# EAGLE board XMICRO-SERIAL V1.0 (EAGLE 6.3)
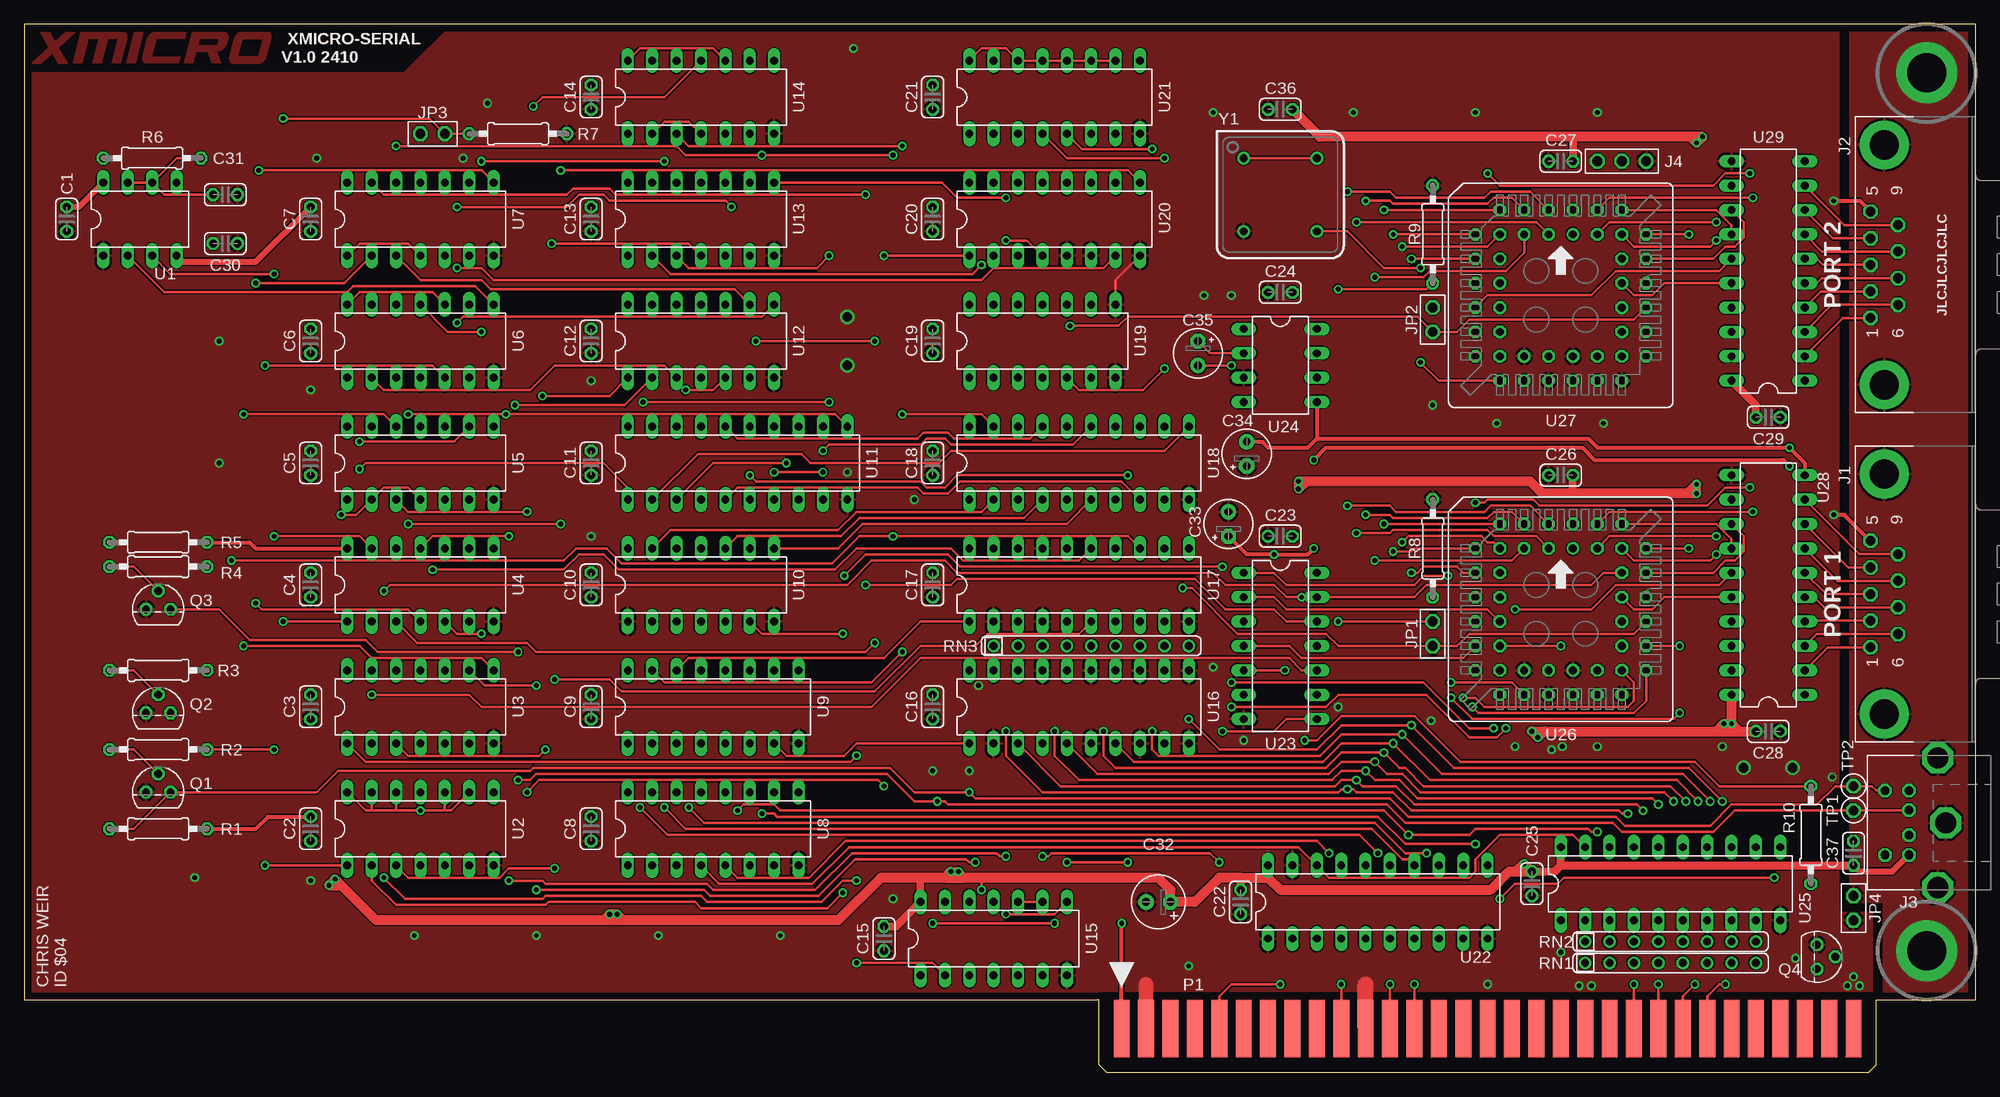
[diagram p6: board, top side]
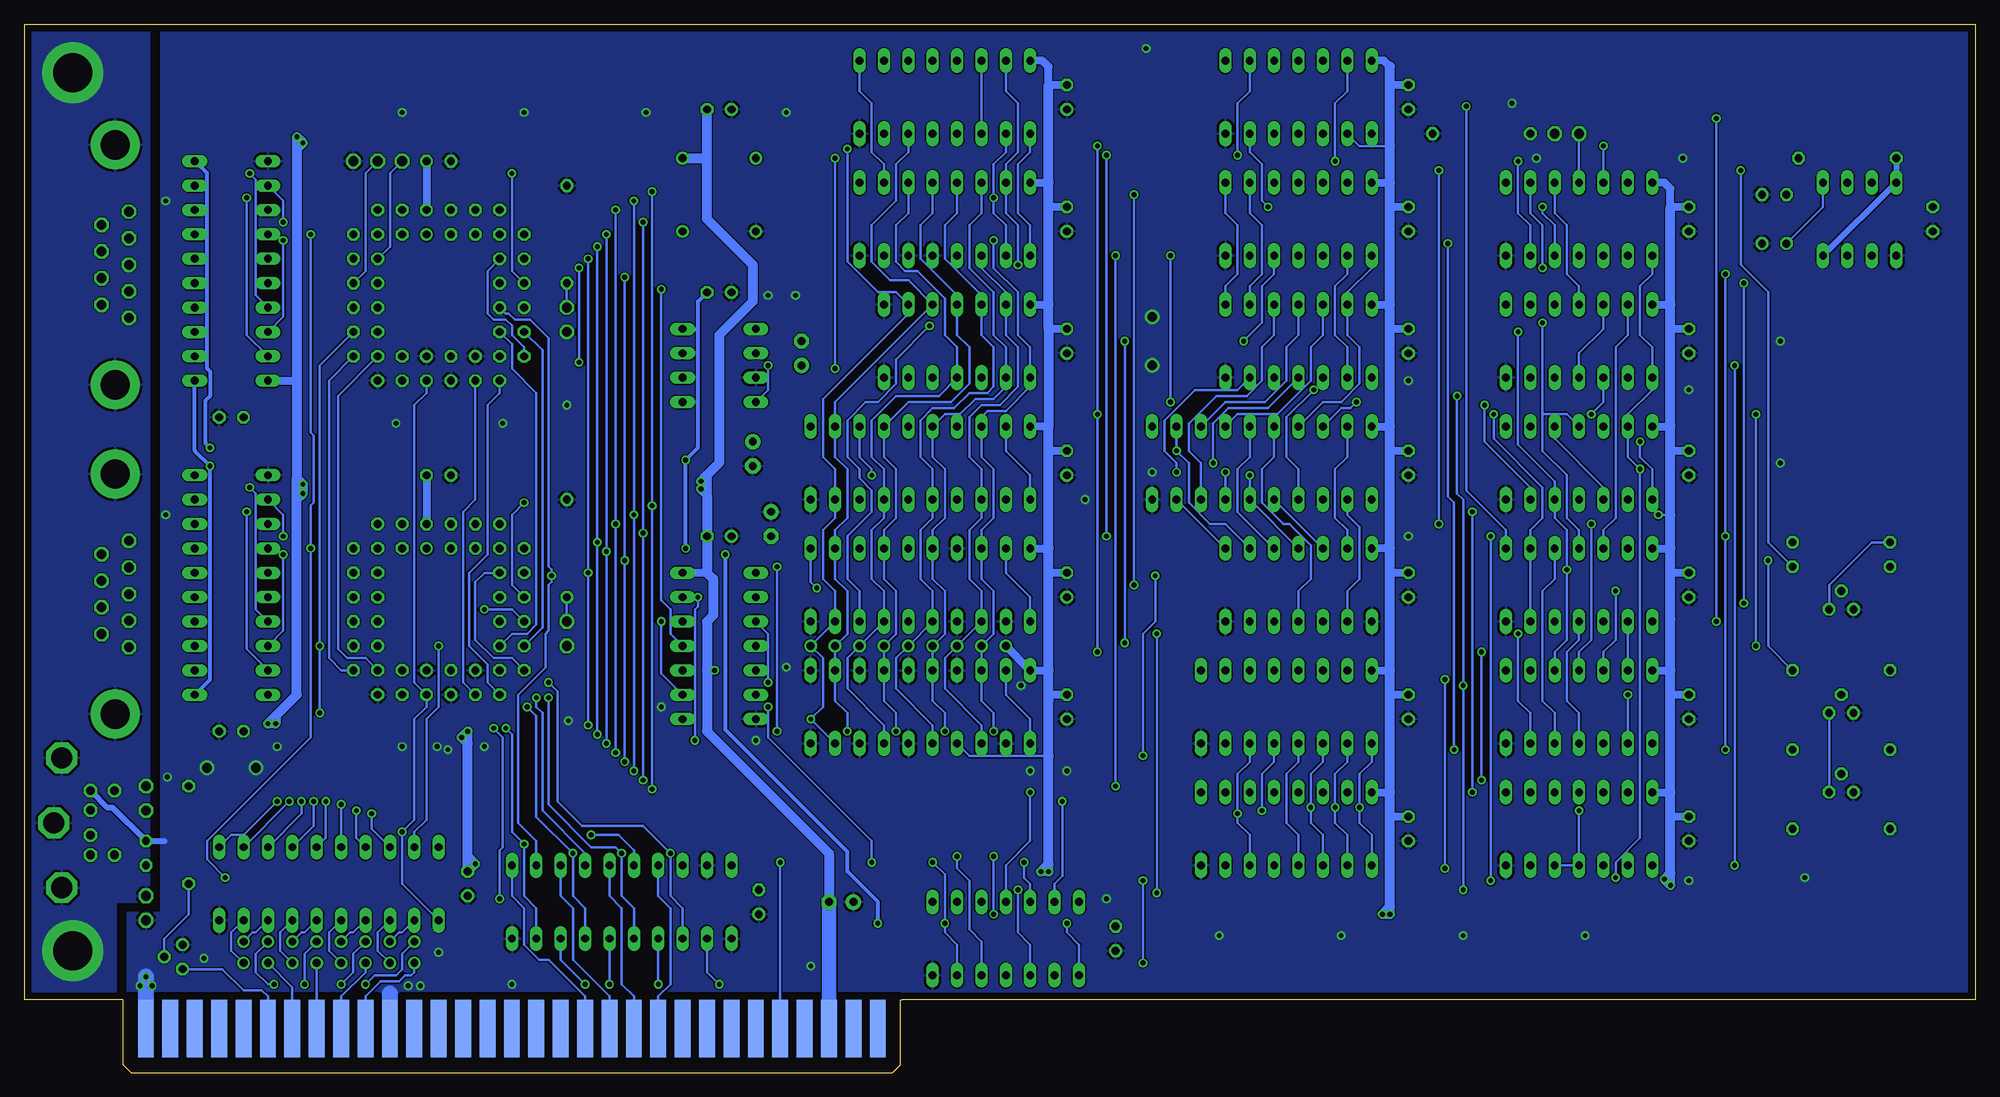
[diagram p7: board, bottom side, seen from below]

Size 203.2 x 109.22 mm. Coordinates in mm from the lower left corner, seen from the top.
Outline: 111.76,7.62 0,7.62 0,109.22 203.2,109.22 203.2,7.62 193.04,7.62
Copper layers (1*16): Top 0.035mm / dielectric 1.5mm / Bottom 0.035mm
Design rules "JLCPCB Standard": minimum track width 5mil, minimum drill 0.3mm, track to track 5mil, track to pad 8mil, pad to pad 8mil, via to via 8mil, smd to smd 5mil, copper to edge 30mil, drill to drill 0.26mm, minimum pad ring 10mil, minimum via ring 8mil, stop-mask expansion 3mil, vias tented up to drill 25mil, thermal gap 10mil
Net classes: 0 default: width 0.254 mm; 1 0V: width 0.254 mm, clearance 0.254 mm to class 0; 2 CHASSIS: width 0.254 mm, clearance 0.762 mm to class 0, clearance 0.762 mm to class 1; 3 SUPPLY: width 0.254 mm, clearance 0.381 mm to class 0, clearance 0.381 mm to class 1, clearance 0.762 mm to class 2, clearance 0.381 mm; 4 LOGO: width 0.127 mm
tKeepout: area 0,107.6 to 203.2,109.2
bKeepout: area 0,107.6 to 203.2,109.2
tRestrict: area 111.9,0 to 192.9,8.4; 4 lines
bRestrict: area 111.9,0 to 192.9,8.4

## Footprints (pad centres in the part's own frame; a part is rotated, then mirrored left to right if it is on the bottom)
C025-024X044 = drill 0.813 octagon: 1 -1.27,0; 2 1.27,0
E2,5-6 = drill 0.813 pad 1.6 octagon: + -1.27,0 | drill 0.813 pad 1.6: - 1.27,0
E2,5-5 = drill 0.813 pad 1.6 octagon: + -1.27,0 | drill 0.813 pad 1.6: - 1.27,0
DSUB-9M-H = drill 1 octagon: 1 -5.54,10.92; 2 -2.77,10.92; 3 0,10.92; 4 2.77,10.92; 5 5.54,10.92; 6 -4.155,8.08; 7 -1.385,8.08; 8 1.385,8.08; 9 4.155,8.08 | drill 3.05 pad 5.08: S1 -12.495,9.5; S2 12.495,9.5
MINI-DIN6 = drill 0.9 octagon: 1 -1.3,-8.51; 2 1.3,-8.51; 3 -3.35,-8.51; 4 3.35,-8.51; 5 -3.35,-11; 6 3.35,-11 | drill 2.2 octagon: G$1 6.76,-5.51; G$2 -6.76,-5.51; G$3 0,-4.7
1X3 = drill 1.016 octagon: 1 -2.54,0; 2 0,0; 3 2.54,0
1X2 = drill 1.016 octagon: 1 -1.27,0; 2 1.27,0
EDGE62M = smd 1.651 x 5.969: 1 -38.1,-3.01; 3 -35.56,-3.01; 5 -33.02,-3.01; 7 -30.48,-3.01; 9 -27.94,-3.01; 11 -25.4,-3.01; 13 -22.86,-3.01; 15 -20.32,-3.01; 17 -17.78,-3.01; 19 -15.24,-3.01; 21 -12.7,-3.01; 23 -10.16,-3.01; 25 -7.62,-3.01; 27 -5.08,-3.01; 29 -2.54,-3.01; 31 0,-3.01; 33 2.54,-3.01; 35 5.08,-3.01; 37 7.62,-3.01; 39 10.16,-3.01; 41 12.7,-3.01; 43 15.24,-3.01; 45 17.78,-3.01; 47 20.32,-3.01; 49 22.86,-3.01; 51 25.4,-3.01; 53 27.94,-3.01; 55 30.48,-3.01; 57 33.02,-3.01; 59 35.56,-3.01; 61 38.1,-3.01 | smd 1.651 x 5.969 bottom: 2 -38.1,-3.01; 4 -35.56,-3.01; 6 -33.02,-3.01; 8 -30.48,-3.01; 10 -27.94,-3.01; 12 -25.4,-3.01; 14 -22.86,-3.01; 16 -20.32,-3.01; 18 -17.78,-3.01; 20 -15.24,-3.01; 22 -12.7,-3.01; 24 -10.16,-3.01; 26 -7.62,-3.01; 28 -5.08,-3.01; 30 -2.54,-3.01; 32 0,-3.01; 34 2.54,-3.01; 36 5.08,-3.01; 38 7.62,-3.01; 40 10.16,-3.01; 42 12.7,-3.01; 44 15.24,-3.01; 46 17.78,-3.01; 48 20.32,-3.01; 50 22.86,-3.01; 52 25.4,-3.01; 54 27.94,-3.01; 56 30.48,-3.01; 58 33.02,-3.01; 60 35.56,-3.01; 62 38.1,-3.01
TO92 = drill 0.813 octagon: 1 -1.27,0; 2 0,1.905; 3 1.27,0
0207/10 = drill 0.813 octagon: 1 -5.08,0; 2 5.08,0
SIL8 = drill 0.813: 1 -8.89,0; 2 -6.35,0; 3 -3.81,0; 4 -1.27,0; 5 1.27,0; 6 3.81,0; 7 6.35,0; 8 8.89,0
SIL9 = drill 0.813: 1 -10.16,0; 2 -7.62,0; 3 -5.08,0; 4 -2.54,0; 5 0,0; 6 2.54,0; 7 5.08,0; 8 7.62,0; 9 10.16,0
TP-040 = drill 1 octagon: 1 0,0
DIL-08 = drill 0.813 long: 1 -3.81,-3.81; 2 -1.27,-3.81; 3 1.27,-3.81; 4 3.81,-3.81; 5 3.81,3.81; 6 1.27,3.81; 7 -1.27,3.81; 8 -3.81,3.81
DIL14 = drill 0.813 long: 1 -7.62,-3.81; 2 -5.08,-3.81; 3 -2.54,-3.81; 4 0,-3.81; 5 2.54,-3.81; 6 5.08,-3.81; 7 7.62,-3.81; 8 7.62,3.81; 9 5.08,3.81; 10 2.54,3.81; 11 0,3.81; 12 -2.54,3.81; 13 -5.08,3.81; 14 -7.62,3.81
DIL16 = drill 0.813 long: 1 -8.89,-3.81; 2 -6.35,-3.81; 3 -3.81,-3.81; 4 -1.27,-3.81; 5 1.27,-3.81; 6 3.81,-3.81; 7 6.35,-3.81; 8 8.89,-3.81; 9 8.89,3.81; 10 6.35,3.81; 11 3.81,3.81; 12 1.27,3.81; 13 -1.27,3.81; 14 -3.81,3.81; 15 -6.35,3.81; 16 -8.89,3.81
DIL20 = drill 0.813 long: 1 -11.43,-3.81; 2 -8.89,-3.81; 3 -6.35,-3.81; 4 -3.81,-3.81; 5 -1.27,-3.81; 6 1.27,-3.81; 7 3.81,-3.81; 8 6.35,-3.81; 9 8.89,-3.81; 10 11.43,-3.81; 11 11.43,3.81; 12 8.89,3.81; 13 6.35,3.81; 14 3.81,3.81; 15 1.27,3.81; 16 -1.27,3.81; 17 -3.81,3.81; 18 -6.35,3.81; 19 -8.89,3.81; 20 -11.43,3.81
DIL8 = drill 0.813 long: 1 -3.81,-3.81; 2 -1.27,-3.81; 3 1.27,-3.81; 4 3.81,-3.81; 5 3.81,3.81; 6 1.27,3.81; 7 -1.27,3.81; 8 -3.81,3.81
S44 = drill 0.813: 1 1.27,6.35 | drill 0.813 octagon: 2 -1.27,8.89; 3 -1.27,6.35; 4 -3.81,8.89; 5 -3.81,6.35; 6 -6.35,8.89; 7 -8.89,6.35; 8 -6.35,6.35; 9 -8.89,3.81; 10 -6.35,3.81; 11 -8.89,1.27; 12 -6.35,1.27; 13 -8.89,-1.27; 14 -6.35,-1.27; 15 -8.89,-3.81; 16 -6.35,-3.81; 17 -8.89,-6.35; 18 -6.35,-8.89; 19 -6.35,-6.35; 20 -3.81,-8.89; 21 -3.81,-6.35; 22 -1.27,-8.89; 23 -1.27,-6.35; 24 1.27,-8.89; 25 1.27,-6.35; 26 3.81,-8.89; 27 3.81,-6.35; 28 6.35,-8.89; 29 8.89,-6.35; 30 6.35,-6.35; 31 8.89,-3.81; 32 6.35,-3.81; 33 8.89,-1.27; 34 6.35,-1.27; 35 8.89,1.27; 36 6.35,1.27; 37 8.89,3.81; 38 6.35,3.81; 39 8.89,6.35; 40 6.35,8.89; 41 6.35,6.35; 42 3.81,8.89; 43 3.81,6.35; 44 1.27,8.89
DIL08S = drill 0.813: 1 -3.81,-3.81; 4 3.81,-3.81; 5 3.81,3.81; 8 -3.81,3.81

## Placement (x,y rotation side)
C1  0.1uF  [C025-024X044]  4.45,88.9 270 top
C2  0.1uF  [C025-024X044]  29.84,25.4 270 top
C3  0.1uF  [C025-024X044]  29.84,38.1 270 top
C4  0.1uF  [C025-024X044]  29.84,50.8 270 top
C5  0.1uF  [C025-024X044]  29.84,63.5 270 top
C6  0.1uF  [C025-024X044]  29.84,76.2 270 top
C7  0.1uF  [C025-024X044]  29.84,88.9 270 top
C8  0.1uF  [C025-024X044]  59.05,25.4 270 top
C9  0.1uF  [C025-024X044]  59.05,38.1 270 top
C10  0.1uF  [C025-024X044]  59.05,50.8 270 top
C11  0.1uF  [C025-024X044]  59.05,63.5 270 top
C12  0.1uF  [C025-024X044]  59.05,76.2 270 top
C13  0.1uF  [C025-024X044]  59.05,88.9 270 top
C14  0.1uF  [C025-024X044]  59.05,101.6 270 top
C15  0.1uF  [C025-024X044]  89.53,13.97 270 top
C16  0.1uF  [C025-024X044]  94.61,38.1 270 top
C17  0.1uF  [C025-024X044]  94.61,50.8 270 top
C18  0.1uF  [C025-024X044]  94.61,63.5 270 top
C19  0.1uF  [C025-024X044]  94.61,76.2 270 top
C20  0.1uF  [C025-024X044]  94.61,88.9 270 top
C21  0.1uF  [C025-024X044]  94.61,101.6 270 top
C22  0.1uF  [C025-024X044]  126.68,17.78 270 top
C23  0.1uF  [C025-024X044]  130.81,55.88 180 top
C24  0.1uF  [C025-024X044]  130.81,81.28 180 top
C25  0.1uF  [C025-024X044]  157,19.68 270 top
C26  0.1uF  [C025-024X044]  160.02,62.23 180 top
C27  0.1uF  [C025-024X044]  160.02,94.93 180 top
C28  0.1uF  [C025-024X044]  181.61,35.56 0 top
C29  0.1uF  [C025-024X044]  181.61,68.26 0 top
C30  10nF  [C025-024X044]  20.95,86.36 0 top
C31  0.1uF  [C025-024X044]  20.95,91.44 0 top
C32  33uF  [E2,5-6]  118.11,17.78 180 top
C33  10uF  [E2,5-5]  125.41,57.15 90 top
C34  10uF  [E2,5-5]  127.32,64.45 90 top
C35  10uF  [E2,5-5]  122.24,74.93 270 top
C36  0.1uF  [C025-024X044]  130.81,100.33 180 top
C37  0.1uF  [C025-024X044]  190.5,22.86 90 top
J1  DSUB-9M-PH  [DSUB-9M-H]  203.2,49.85 90 top
J2  DSUB-9M-PH  [DSUB-9M-H]  203.2,84.14 90 top
J3  MINI-DIN6  [MINI-DIN6]  204.79,26.04 270 top
J4  1X3  [1X3]  166.37,94.93 180 top
JP1  1X2-THRU  [1X2]  146.69,45.72 90 top
JP2  1X2-THRU  [1X2]  146.69,78.42 90 top
JP3  1X2-THRU  [1X2]  42.55,97.79 0 top
JP4  1X2-THRU  [1X2]  190.5,17.14 90 top
P1  XMICRO-BUS-EDGE  [EDGE62M]  152.4,7.62 0 top
Q1  2N5088  [TO92]  13.97,29.21 0 top
Q2  2N5088  [TO92]  13.97,37.46 0 top
Q3  2N5088  [TO92]  13.97,48.26 0 top
Q4  VN2106  [TO92]  186.69,12.07 270 top
R1  10k  [0207/10]  13.97,25.4 0 top
R2  100k  [0207/10]  13.97,33.66 180 top
R3  100k  [0207/10]  13.97,41.91 180 top
R4  100k  [0207/10]  13.97,52.7 180 top
R5  10k  [0207/10]  13.97,55.24 0 top
R6  1.2k  [0207/10]  13.34,95.25 0 top
R7  10k  [0207/10]  51.44,97.79 0 top
R8  10k  [0207/10]  146.69,54.61 270 top
R9  10k  [0207/10]  146.69,87.31 270 top
R10  0  [0207/10]  186.06,24.77 270 top
RN1  10  [SIL8]  171.45,11.43 0 top
RN2  10  [SIL8]  171.45,13.65 0 top
RN3  10k  [SIL9]  111.12,44.45 0 top
TP1  TP-040  [TP-040]  190.5,27.3 90 top
TP2  TP-040  [TP-040]  190.5,29.85 90 top
U1  555  [DIL-08]  12.06,88.9 0 top
U2  74HCT86N  [DIL14]  41.27,25.4 0 top
U3  74HCT10N  [DIL14]  41.27,38.1 0 top
U4  74HCT04N  [DIL14]  41.27,50.8 0 top
U5  74HCT74N  [DIL14]  41.27,63.5 0 top
U6  74HCT74N  [DIL14]  41.27,76.2 0 top
U7  74HCT08N  [DIL14]  41.27,88.9 0 top
U8  74F138N  [DIL16]  71.75,25.4 0 top
U9  74F138N  [DIL16]  71.75,38.1 0 top
U10  74HCT280N  [DIL14]  70.48,50.8 0 top
U11  74HCT273N  [DIL20]  74.3,63.5 0 top
U12  74HCT164N  [DIL14]  70.48,76.2 0 top
U13  74HCT164N  [DIL14]  70.48,88.9 0 top
U14  74HCT74N  [DIL14]  70.48,101.6 0 top
U15  74HCT14N  [DIL14]  100.97,13.97 0 top
U16  74HCT244N  [DIL20]  109.86,38.1 0 top
U17  74HCT244N  [DIL20]  109.86,50.8 0 top
U18  74HCT240N  [DIL20]  109.86,63.5 0 top
U19  74HCT280N  [DIL14]  106.05,76.2 0 top
U20  74HCT165N  [DIL16]  107.31,88.9 0 top
U21  74HCT165N  [DIL16]  107.31,101.6 0 top
U22  74ABT244N  [DIL20]  140.97,17.78 0 top
U23  74HCT04N  [DIL14]  130.81,44.45 270 top
U24  TC962  [DIL8]  130.81,73.66 270 top
U25  74ABT245N  [DIL20]  171.45,19.68 0 top
U26  16C550  [S44]  160.02,48.26 0 top
U27  16C550  [S44]  160.02,80.96 0 top
U28  75185N  [DIL20]  181.61,50.8 90 top
U29  75185N  [DIL20]  181.61,83.5 90 top
Y1  1.8432MHz  [DIL08S]  130.81,91.44 270 top

## Tracks (layer width: path | path; a pad name or v marks a point on that pad's centre or on a via)
0V  (via drill 0.5, 1)  (1 unrouted)
  Top 0.254: U19.8 113.67,82.55 U20.8
  Top 0.406: J1.5 192.26,55.39 189.55,58.1 v188.44,58.1 | v188.44,90.81 191.15,90.81 J2.5
  Top 1.524: P1.4 116.84,9.21
  Top 1.651: P1.21 139.7,9.21
  Bottom 0.61: J3.3 194.51,27.62 193.99,27.62 C37.2 188.59,24.13
  Bottom 1.651: P1.62 v190.5,10 | P1.42 165.1,8.26
  other vias: 189.87,9.05 191.13,9.05 92.71,59.69 160.18,33.97 159.07,33.66 176.85,33.97 99.38,40.32 59.05,55.88 85.72,62.55 59.05,72.07 29.84,71.12 94.61,31.43 98.42,31.43 78.74,14.29 90.49,18.1 66.04,14.29 53.34,14.29 40.64,14.29 29.84,20 17.78,20.32 20.32,63.5 20.32,76.2 30.48,95.25 45.72,95.25 48.26,100.97 86.36,106.68 123.83,100.01 138.43,100.01 151.13,100.01 163.83,100.01 125.73,80.96 122.87,80.96 146.69,69.53 136.84,38.1 146.53,36.67 163.83,33.97 153.35,67.63 164.47,67.63 123.83,42.23 155.26,33.97 160.02,12.54 184.47,11.91 188.28,30.8 121.28,11.11 152.4,9.21 127,34.61 161.93,9.05 163.19,9.05 179.07,31.75 184.15,31.75 85.72,78.74 85.72,73.66
  pour Top (rank 3): 0,109.22 188.91,109.22 188.91,16.64 192.41,16.64 192.41,7.62 0,7.62
  pour Bottom (rank 3): 0,109.22 188.91,109.22 188.91,16.64 192.41,16.64 192.41,7.62 0,7.62
!BCSX  (via drill 0.5)
  Top 0.254: P1.9 124.46,7.94 125.73,9.21 v130.81,9.21
  Bottom 0.254: v130.81,9.21 132.08,10.48 U22.2
!BIRQX
  Bottom 0.254: P1.52 177.8,7.94 178.44,8.57 180.34,8.57 182.56,10.79 Q4.3
!BRD  (via drill 0.5)
  Top 0.254: P1.19 v137.16,9.21
  Bottom 0.254: v137.16,9.21 U22.4
!BRST  (via drill 0.5)
  Top 0.254: v124.46,21.91 123.51,22.86 107,22.86 106.68,22.54 v106.05,22.54
  Bottom 0.254: P1.10 v124.46,21.91 | v106.05,22.54 106.05,21.27 104.78,20 104.78,14.92 103.5,13.65 U15.5
!BWR
  Bottom 0.254: P1.20 137.16,7.94 135.89,9.21 135.89,17.14 137.16,18.41 U22.17
!CS_IDR
  Top 0.254: U9.7 79.38,33.02 85.41,33.02 86.68,34.29 U16.1
  Bottom 0.254: U16.19 100.97,39.37 98.42,36.83 U16.1
!CS_KBR  (via drill 0.5)
  Top 0.254: U14.3 69.22,96.52 v91.44,96.52 | v91.44,68.58 99.69,68.58 U18.19 | U9.15 66.67,40.64 88.27,40.64 v91.44,43.81
  Bottom 0.254: v91.44,96.52 v91.44,68.58 v91.44,43.81 | U18.1 98.42,62.23 100.97,64.77 U18.19
!CS_KBW  (via drill 0.5)
  Top 0.254: U8.15 65.41,30.48 | 65.41,30.48 88.9,30.48 v89.53,29.85 | v89.53,85.09 U20.1 | U5.3 40.01,58.42 v52.39,58.42 | v52.39,29.21 53.66,30.48 65.41,30.48
  Bottom 0.254: U20.1 98.42,88.27 99.69,89.54 99.69,94.62 98.42,95.89 U21.1 | v89.53,29.85 v89.53,85.09 | U5.3 38.73,60.96 43.81,66.04 U5.10 | v52.39,58.42 v52.39,29.21
!CS_STR
  Top 0.254: U17.1 93.34,46.99 89.53,43.18 69.22,43.18 U9.14
  Bottom 0.254: U17.1 98.42,49.53 100.97,52.07 U17.19
!CSX  (via drill 0.5)
  Top 0.254: v160.02,44.45 U26.16 | U25.19 161.29,24.77 153.67,24.77 151.13,22.23 151.13,20.96 150.5,20.32 135.89,20.32 U22.18 132.72,23.5 85.88,23.5 82.07,19.68 72.39,19.68 U8.4
  Bottom 0.254: U9.4 70.48,32.38 71.75,31.12 71.75,26.04 70.48,24.77 U8.4 | U27.16 152.4,75.88 152.4,73.34 149.86,70.8 149.86,46.67 150.81,45.72 152.4,45.72 U26.16 | U25.19 162.56,25.08 161.29,26.35 161.29,36.83 160.02,38.1 v160.02,44.45
!KB_DATA  (via drill 0.5)
  Top 0.254: U12.1 60.96,70.48 v53.98,70.48 | U3.9 47.94,40.32 v53.34,40.32 | v53.34,19.05 70.8,19.05 71.44,18.41 82.71,18.41 86.52,22.23 98.11,22.23 98.42,21.91 v99.06,21.91
  Bottom 0.254: v53.98,70.48 53.98,60.32 53.34,59.69 v53.34,40.32 v53.34,19.05 | v99.06,21.91 99.06,20.32 98.42,19.68 U15.12
!KB_INT_ENABLE
  Top 0.254: U23.13 144.78,49.53 146.05,50.8 163.19,50.8 164.47,52.07 U26.38
!KB_WRCYCLE  (via drill 0.5)
  Top 0.254: U13.2 67.31,83.19 98.74,83.19 v99.69,84.14 | U12.2 62.55,69.53 v51.12,69.53
  Bottom 0.254: U21.15 100.97,102.23 99.69,100.97 99.69,95.89 100.97,94.62 U20.15 100.97,89.54 99.69,88.27 v99.69,84.14 | U12.2 65.41,75.56 66.67,76.84 66.67,81.92 65.41,83.19 U13.2 | v51.12,69.53 51.12,65.72 46.35,60.96 U5.6
!RD  (via drill 0.5)
  Top 0.254: v163.83,25.08 163.19,25.08 162.88,25.4 151.13,25.4 150.5,24.77 v144.15,24.77 141.6,27.3 78.74,27.3 78.11,27.94 74.93,27.94 v74.3,27.3
  Bottom 0.254: U27.24 161.29,70.8 162.56,69.53 162.56,40.64 U26.24 161.29,38.1 162.56,36.83 162.56,26.35 v163.83,25.08 163.83,19.68 U25.1 | v144.15,24.77 141.29,24.77 139.7,23.18 U22.16 | U9.5 73.03,32.38 74.3,31.12 v74.3,27.3
!RST  (via drill 0.5)
  Top 0.254: U7.1 34.92,86.36 40.01,86.36 U7.4 | U11.1 62.87,60.96 60.33,63.5 35.56,63.5 v34.92,62.86 | v37.47,20.32 39.69,18.1 53.98,18.1 54.29,18.41 70.48,18.41 71.12,17.78 83.03,17.78 85.25,20 v86.68,20 | v86.68,11.43 94.61,11.43 U15.2
  Bottom 0.254: U7.1 33.66,83.19 34.92,81.92 34.92,76.84 33.66,75.56 U6.1 33.66,71.12 36.2,68.58 U5.13 36.2,64.14 v34.92,62.86 34.92,24.45 37.47,21.91 v37.47,20.32 | v86.68,20 v86.68,11.43
!WR  (via drill 0.5)
  Top 0.254: v148.59,40.64 154.94,40.64 U26.20 | v135.89,22.86 134.62,24.13 85.57,24.13 81.76,20.32 74.3,20.32 U8.5
  Bottom 0.254: U22.3 134.62,17.14 135.89,18.41 v135.89,22.86 138.75,25.72 145.1,25.72 147.64,28.26 147.64,39.69 v148.59,40.64 | U27.20 156.21,59.69 157.48,58.42 157.48,40.64 U26.20
+5V  (via drill 0.5)  (1 unrouted)
  Top 0.254: U21.16 99.69,106.68 102.23,106.68 U21.14 U21.13 U21.12 U21.11 U21.10 | U14.2 66.67,99.06 69.22,99.06 U14.4 | U14.14 64.14,106.68 67.94,106.68 | 67.94,106.68 71.75,106.68 U14.10 | U14.12 67.94,106.68 | U5.4 40.01,60.96 37.47,60.96 U5.2 34.61,58.1 v33.02,58.1 | U6.10 42.55,81.28 38.73,81.28 | 38.73,81.28 34.92,81.28 U6.14 | U6.12 38.73,81.28 | 38.73,27.3 v41.27,27.3 43.81,27.3 | 38.73,27.3 36.2,27.3 | 36.2,27.3 35.56,27.3 U2.14 | U2.13 36.2,27.3 | U2.12 38.73,27.3 | 43.81,27.3 44.45,27.3 U2.9 | U2.10 43.81,27.3 | v99.69,19.05 99.69,20.32 | Y1.8 Y1.1 | v131.29,41.91 U23.5
  Top 0.406: R1.2 24.13,25.4 25.4,26.67 C2.1 | R5.2 23.5,55.24 24.13,54.61 U4.14
  Top 0.61: U1.8 5.71,90.17 C1.1 | U1.4 16.51,84.45 24.13,84.45 C7.1 | C37.1 191.13,20.96 194.55,20.96 J3.4
  Top 0.813: 161.29,60.32 C26.1 | 126.68,20.32 C22.1 | C25.1 159.38,20.96 160.02,21.59 | 160.02,21.59 U25.20 | U22.20 129.54,20.32 | 161.29,97.47 C27.1 | 97.95,20.32 v97.31,20.96 v96.52,20.96 | 160.02,21.59 C37.1 | C15.1 90.81,15.24 U15.14 93.34,20.32 | C29.1 180.34,69.53 U29.20
  Top 1.016: 155.42,20.96 C25.1 v156.21,21.75 155.42,20.96 | 173.2,60.32 v174.15,61.28 v174.15,60.32 173.2,60.32 | 173.2,60.32 161.29,60.32 158.12,60.32 156.84,61.59 133.51,61.59 | 158.27,35.56 v157,35.56 v157.64,34.92 158.27,35.56 | 158.27,35.56 176.21,35.56 | 176.21,35.56 v177.01,36.35 v177.8,36.35 | v177.8,36.35 178.59,35.56 | 176.21,35.56 178.59,35.56 | 178.59,35.56 C28.1 | 173.51,97.47 v174.78,97.47 v174.15,96.84 173.51,97.47 | 173.51,97.47 161.29,97.47 134.94,97.47 C36.1 | 95.89,20.32 97.95,20.32 99.69,20.32 118.11,20.32 119.38,19.05 C32.+ 121.92,17.78 124.46,20.32 126.68,20.32 129.54,20.32 130.81,19.05 152.72,19.05 154.62,20.96 155.42,20.96 | v96.52,20.96 95.89,20.32 | 95.89,20.32 93.34,20.32 89.22,20.32 84.77,15.88 62.39,15.88 | 62.39,15.88 60.33,15.88 | 60.33,15.88 v60.96,16.51 v61.75,16.51 62.39,15.88 | 60.33,15.88 36.67,15.88 33.02,19.53 | 133.51,61.59 v132.72,61.59 v132.72,60.8 133.51,61.59 | 33.02,19.53 v32.38,20.16 v31.75,19.53 33.02,19.53 | U28.20 v177.8,36.35
  Bottom 0.254: U21.3 U21.14 | U14.2 64.14,96.52 60.96,96.52 | U6.4 41.27,74.93 38.73,77.47 U6.12 | v33.02,58.1 31.75,58.1 | v41.27,27.3 U2.4 U2.5 | 32.07,46.99 31.75,47.31 | v99.69,19.05 99.69,14.61 98.42,13.34 U15.3 | U16.4 104.78,33.02 96.52,33.02
  Bottom 0.406: 96.52,39.05 96.52,38.73
  Bottom 0.61: U1.4 U1.8 R6.1
  Bottom 0.813: C16.1 96.52,39.37 | 96.52,67.31 U18.20 | C18.1 96.52,64.77 | C17.1 96.52,52.07 | U17.20 96.52,54.61 | 96.52,41.91 U16.20 RN3.1 | C8.1 60.96,26.67 | 60.96,54.61 U10.14 | C10.1 60.96,52.07 | U9.16 60.96,41.91 | C9.1 60.96,39.37 | U21.16 97.16,105.41 96.52,104.78 96.52,102.87 C21.1 | C20.1 96.52,90.17 | U20.16 96.52,92.71 | U19.14 96.52,80.01 | C19.1 96.52,77.47 | 60.96,104.78 61.59,105.41 U14.14 | C14.1 60.96,102.87 | C13.1 60.96,90.17 | U13.14 60.96,92.71 | U12.14 60.96,80.01 | C12.1 60.96,77.47 | C11.1 60.96,64.77 | U11.20 60.96,67.31 | C26.1 U26.44 | C27.1 U27.44 | C2.1 31.75,26.67 | U7.14 32.38,92.71 31.75,92.08 31.75,90.17 C7.1 | C6.1 31.75,77.47 | U6.14 31.75,80.01 | C5.1 31.75,64.77 | U5.14 31.75,67.31 | U4.14 31.75,54.61 | C4.1 31.75,52.07 | C3.1 31.75,39.37 | U3.14 31.75,41.91 | U2.14 31.75,29.21 | 132.08,52.07 U23.14 | v132.72,61.59 v132.72,60.8 | U29.20 174.78,72.07 | U8.16 60.96,29.21
  Bottom 0.889: v131.29,41.91 132.08,41.91
  Bottom 1.016: 96.52,102.87 96.52,92.71 96.52,90.17 96.52,80.01 96.52,77.47 96.52,67.31 96.52,64.77 96.52,54.61 96.52,52.07 96.52,41.91 96.52,39.37 96.52,38.73 96.52,33.02 96.52,21.75 | 60.96,104.78 60.96,102.87 60.96,96.52 60.96,92.71 60.96,90.17 60.96,80.01 60.96,77.47 60.96,67.31 60.96,64.77 60.96,54.61 60.96,52.07 60.96,41.91 60.96,39.37 60.96,29.21 60.96,26.67 60.96,17.3 | 157,22.54 v156.21,21.75 C25.1 157,22.54 | 157,22.54 157,34.29 | 157,34.29 v157,35.56 v157.64,34.92 157,34.29 | 174.78,59.69 174.78,39.37 177.01,37.15 | 174.78,59.69 v174.15,60.32 v174.15,61.28 174.78,61.91 | 174.78,96.2 v174.15,96.84 v174.78,97.47 174.78,96.2 | 174.78,96.2 174.78,72.07 174.78,61.91 | 174.78,59.69 174.78,61.91 | 96.52,21.75 v96.52,20.96 v97.31,20.96 96.52,21.75 | 60.96,17.3 v60.96,16.51 v61.75,16.51 60.96,17.3 | 31.75,90.17 31.75,80.01 31.75,77.47 31.75,67.31 31.75,64.77 31.75,58.1 31.75,54.61 31.75,52.07 31.75,47.31 31.75,41.91 31.75,39.37 31.75,29.21 31.75,26.67 31.75,20.8 | 31.75,20.8 v31.75,19.53 v32.38,20.16 31.75,20.8 | 132.08,62.23 130.81,63.5 130.81,76.84 127.32,80.33 127.32,84.14 132.08,88.9 132.08,95.25 | 132.08,60.17 132.08,62.23 | 132.08,62.23 v132.72,61.59 | v132.72,60.8 132.08,60.17 | 132.08,60.17 C23.1 132.08,52.07 131.44,51.43 131.44,47.62 132.08,46.99 132.08,41.91 132.08,35.56 119.38,22.86 C32.+ | 177.01,37.15 v177.8,36.35 v177.01,36.35 177.01,37.15 | 132.08,95.25 C36.1 | Y1.8 132.08,95.25
  Bottom 1.524: C32.+ P1.6
+12V  (via drill 0.5)
  Top 0.406: P1.1 v114.3,15.56 | v134.3,54.61 133.67,53.97 v130.18,53.97 127.32,53.97 C33.+ | v134.3,63.82 135.57,65.09 162.24,65.09 163.51,63.82 183.2,63.82 v183.83,63.18
  Bottom 0.406: U28.1 183.83,40.96 v183.83,63.18 185.42,64.77 U29.1 | v114.3,15.56 114.3,17.78 117.47,20.96 117.47,23.02 130.18,35.72 v130.18,53.97 | v134.3,54.61 v134.3,63.82 133.03,65.09 133.03,77.47 | 133.03,77.47 133.03,80.33 C24.1 | U24.8 133.03,77.47
-12V  (via drill 0.5)
  Top 0.406: U24.5 134.62,66.04 | 134.62,66.04 162.88,66.04 163.83,65.09 v183.83,65.09 185.42,63.5 U28.10 | C34.- 128.91,65.72 129.54,65.09 133.67,65.09 134.62,66.04
  Bottom 0.406: U29.10 184.15,93.66 184.15,73.34 183.83,73.03 183.83,70.48 184.31,70.01 184.31,65.56 v183.83,65.09
A0  (via drill 0.5)
  Top 0.254: v172.4,44.45 U26.31 | v148.59,39.05 150.81,36.83 171.77,36.83 v172.4,37.46 | v140.97,22.86 139.06,24.77 66.99,24.77 v64.14,27.62
  Bottom 0.254: U9.1 62.87,32.38 64.14,31.12 v64.14,27.62 64.14,26.04 62.87,24.77 U8.1 | U22.5 139.7,17.14 140.97,18.41 v140.97,22.86 141.6,23.5 144.15,23.5 148.59,27.94 v148.59,39.05 | v172.4,37.46 v172.4,44.45 172.4,73.66 U27.31
A1  (via drill 0.5)
  Top 0.254: v149.86,39.05 151.13,39.05 152.08,38.1 167,38.1 167.64,38.73 167.64,40.64 U26.30 | U22.14 144.15,22.23 143.51,22.23 140.34,25.4 68.9,25.4 v66.67,27.62
  Bottom 0.254: U9.2 65.41,32.38 66.67,31.12 v66.67,27.62 66.67,26.04 65.41,24.77 U8.2 | v149.86,39.05 149.86,38.1 149.22,37.46 149.22,27.3 144.78,22.86 U22.14 | U26.30 167.64,43.18 169.54,43.18 170.5,44.13 170.5,70.48 U27.30
A2  (via drill 0.5)
  Top 0.254: v150.81,38.1 151.45,37.46 167.64,37.46 168.91,38.73 U26.29 | v146.05,22.86 143.83,22.86 140.65,26.04 70.8,26.04 v69.22,27.62
  Bottom 0.254: U8.3 67.94,24.77 69.22,26.04 v69.22,27.62 69.22,31.12 67.94,32.38 U9.3 | U22.7 144.78,17.14 146.05,18.41 v146.05,22.86 149.86,26.67 149.86,37.15 v150.81,38.1 | U27.29 171.45,72.07 171.45,43.18 170.18,41.91 U26.29
A3  (via drill 0.5)
  Top 0.254: U23.1 130.18,52.07 131.44,50.8 144.78,50.8 145.73,51.75 v148.27,51.75
  Bottom 0.254: U22.12 149.86,24.13 151.76,26.04 151.76,39.37 148.91,42.23 148.91,45.72 148.59,46.04 148.59,50.8 148.27,51.12 v148.27,51.75 148.27,52.39 148.59,52.7 148.59,76.52 150.5,78.42 152.08,78.42 152.72,79.06 153.03,79.06 U27.14
A4  (via drill 0.5)
  Top 0.254: v153.03,35.88 150.5,35.88 145.73,40.64 v125.73,40.64 | v151.13,23.81 143.83,23.81 140.97,26.67 78.42,26.67 78.11,26.99 v76.83,26.99
  Bottom 0.254: U8.6 75.56,24.77 76.83,26.04 v76.83,26.99 76.83,31.12 75.56,32.38 U9.6 | U22.9 149.86,17.14 151.13,18.41 v151.13,23.81 152.4,25.08 152.4,35.24 v153.03,35.88 | U23.3 125.73,45.72 v125.73,40.64
BA0
  Bottom 0.254: U22.15 142.24,18.41 140.97,17.14 140.97,9.21 139.7,7.94 P1.22
BA1  (via drill 0.5)
  Top 0.254: v142.24,9.21 P1.23
  Bottom 0.254: U22.6 v142.24,9.21
BA2
  Bottom 0.254: U22.13 147.32,18.41 146.05,17.14 146.05,11.75 142.24,7.94 P1.24
BA3  (via drill 0.5)
  Top 0.254: v144.78,9.21 P1.25
  Bottom 0.254: v144.78,9.21 147.32,11.75 U22.8
BA4
  Bottom 0.254: U22.11 152.4,18.41 151.13,17.14 151.13,13.34 149.54,11.75 148.59,11.75 144.78,7.94 P1.26
BUFF_KB_CLOCK  (via drill 0.5)
  Top 0.254: U13.8 95.57,92.71 97.16,91.12 v102.23,91.12 | v45.09,78.11 45.72,78.74 76.83,78.74 U12.8 | v50.48,55.88 42.55,55.88 U4.11 | v50.48,20 53.98,20 54.29,19.68 71.12,19.68 71.75,19.05 82.39,19.05 86.2,22.86 101.28,22.86 101.6,22.54 v102.23,22.54 | U15.8 107.31,16.51 v102.23,16.51
  Bottom 0.254: U20.2 100.97,88.27 102.23,89.54 v102.23,91.12 102.23,94.62 100.97,95.89 U21.2 | U12.8 78.11,81.92 76.83,83.19 76.83,88.27 78.11,89.54 U13.8 | U4.11 41.27,56.52 42.55,57.78 42.55,62.23 45.09,64.77 45.09,68.58 | 45.09,68.58 v45.09,78.11 | U5.11 42.55,68.58 45.09,68.58 | v50.48,20 v50.48,55.88 | v102.23,16.51 v102.23,22.54
CGND  (via drill 4.06 pad 6.35)
  other vias: 198.12,104.14 198.12,12.7
  pour Bottom: 203.2,109.22 190.18,109.22 190.18,17.78 193.68,17.78 193.68,7.62 203.2,7.62
  pour Top: 203.2,109.22 190.18,109.22 190.18,17.78 193.68,17.78 193.68,7.62 203.2,7.62
D0  (via drill 0.5)
  Top 0.254: v102.23,86.68 104.46,86.68 U20.4 | v102.23,35.56 102.23,33.02 106.05,29.21 136.84,29.21 137.16,29.53 v137.79,29.53 138.43,29.53 138.75,29.21 142.56,29.21 144.46,27.3 166.05,27.3 166.37,26.99 v167,26.99 | U27.2 156.84,91.76 152.72,91.76 152.08,91.12 142.88,91.12 142.24,91.76 v137.79,91.76 | U26.2 156.84,59.05 152.72,59.05 152.08,58.42 142.88,58.42 142.24,59.05 v137.79,59.05
  Bottom 0.254: v102.23,86.68 102.23,83.82 99.69,81.28 99.69,76.84 98.42,75.56 U19.1 98.42,71.44 100.97,68.9 102.87,68.9 103.5,68.26 U18.18 103.5,64.14 102.23,62.86 102.23,57.78 103.5,56.52 U17.18 103.5,51.43 102.23,50.16 102.23,45.72 RN3.2 U16.18 103.5,38.73 102.23,37.46 v102.23,35.56 | v137.79,29.53 v137.79,59.05 v137.79,91.76 | U25.18 167,25.4 v167,26.99
D1  (via drill 0.5)
  Top 0.254: U16.3 107.95,29.85 136.53,29.85 137.16,30.48 v138.75,30.48 139.38,29.85 142.88,29.85 144.78,27.94 167.96,27.94 v168.59,27.3 | U27.3 157.48,88.58 v138.75,88.58 | U26.3 157.48,55.88 153.03,55.88 152.4,56.52 142.56,56.52 142.24,56.2 v138.75,56.2
  Bottom 0.254: U20.3 103.5,83.82 100.97,81.28 U19.13 100.97,76.84 99.69,75.56 99.69,71.44 101.6,69.53 103.5,69.53 104.78,68.26 104.78,64.14 103.5,62.86 U18.3 103.5,57.78 104.78,56.52 104.78,51.43 103.5,50.16 U17.3 RN3.3 107.31,43.18 107.31,40 103.5,36.2 U16.3 | v138.75,30.48 v138.75,56.2 v138.75,88.58 | U25.17 168.59,24.45 v168.59,27.3
D2  (via drill 0.5)
  Top 0.254: v107.31,35.56 107.31,33.02 109.86,30.48 136.21,30.48 137.16,31.43 v139.7,31.43 140.65,30.48 143.19,30.48 145.1,28.57 169.54,28.57 v170.18,27.94 | U27.4 154.94,91.12 153.03,91.12 152.4,90.49 142.56,90.49 142.24,90.81 v139.7,90.81 | U26.4 154.94,58.42 153.03,58.42 152.4,57.78 142.56,57.78 142.24,58.1 v139.7,58.1
  Bottom 0.254: U20.14 103.5,89.54 104.78,88.27 104.78,83.82 102.23,81.28 102.23,76.84 100.97,75.56 U19.2 100.97,71.44 102.23,70.17 104.14,70.17 105.73,68.58 107.31,68.58 U18.16 108.58,64.14 107.31,62.86 107.31,57.78 108.58,56.52 U17.16 108.58,51.43 107.31,50.16 107.31,45.72 RN3.4 U16.16 108.58,38.73 107.31,37.46 v107.31,35.56 | v139.7,31.43 v139.7,58.1 v139.7,90.81 | U25.16 v170.18,27.94
D3  (via drill 0.5)
  Top 0.254: U16.5 111.76,31.12 135.89,31.12 137.16,32.38 v140.65,32.38 141.92,31.12 143.51,31.12 145.41,29.21 170.81,29.21 v171.77,28.26 | U27.5 156.21,85.41 154.31,83.5 146.37,83.5 145.73,82.87 v140.65,82.87 | U26.5 154.94,53.34 v140.65,53.34
  Bottom 0.254: U20.13 106.05,89.54 107.31,88.27 107.31,84.77 103.5,80.96 U19.12 103.5,76.84 102.23,75.56 102.23,71.44 102.87,70.8 104.78,70.8 106.36,69.22 108.58,69.22 109.86,67.95 109.86,64.14 108.58,62.86 U18.5 108.58,57.78 109.86,56.52 109.86,51.43 108.58,50.16 U17.5 RN3.5 112.39,43.18 112.39,40 108.58,36.2 U16.5 | v140.65,32.38 v140.65,53.34 v140.65,82.87 | U25.15 171.77,24.45 v171.77,28.26
D4  (via drill 0.5)
  Top 0.254: v112.39,35.56 112.39,33.02 113.67,31.75 135.57,31.75 137.16,33.34 v141.6,33.34 143.19,31.75 143.83,31.75 145.73,29.85 171.45,29.85 v173.04,28.26 | U27.6 v141.6,89.85 | U26.6 v141.6,57.15
  Bottom 0.254: U20.12 108.58,89.54 109.86,88.27 109.86,84.77 106.05,80.96 U19.11 106.05,76.84 104.78,75.56 104.78,71.76 106.68,69.85 111.12,69.85 U18.14 113.67,64.14 112.39,62.86 112.39,57.78 113.67,56.52 U17.14 113.67,51.43 112.39,50.16 112.39,45.72 RN3.6 U16.14 113.67,38.73 112.39,37.46 v112.39,35.56 | v141.6,33.34 v141.6,57.15 v141.6,89.85 | v173.04,28.26 173.04,25.72 U25.14
D5  (via drill 0.5)
  Top 0.254: U16.7 115.57,32.38 135.25,32.38 137.16,34.29 v142.56,34.29 146.37,30.48 172.09,30.48 v174.31,28.26 | U27.7 v142.56,87.31 | U26.7 144.78,54.61 144.46,54.29 v142.56,54.29
  Bottom 0.254: U20.11 111.12,89.54 112.39,88.27 112.39,84.45 111.44,83.5 110.17,83.5 107.31,80.65 107.31,76.84 106.05,75.56 U19.4 107.95,70.48 112.39,70.48 114.94,67.95 114.94,64.14 113.67,62.86 U18.7 113.67,57.78 114.94,56.52 114.94,51.43 113.67,50.16 U17.7 RN3.7 117.47,43.18 117.47,40 113.67,36.2 U16.7 | v142.56,34.29 v142.56,54.29 v142.56,87.31 | v174.31,28.26 174.31,26.99 U25.13
D6  (via drill 0.5)
  Top 0.254: v117.47,35.56 117.47,33.66 118.11,33.02 134.94,33.02 137.16,35.24 v143.51,35.24 147.64,31.12 172.72,31.12 v175.58,28.26 | U27.8 152.4,86.04 v143.51,86.04 | U26.8 153.03,55.24 152.4,55.24 151.76,55.88 144.15,55.88 v143.51,55.24
  Bottom 0.254: U21.6 111.12,95.89 112.39,94.62 112.39,90.81 114.94,88.27 114.94,84.45 113.03,82.55 111.12,82.55 U19.10 118.75,69.85 U18.12 118.75,64.14 117.47,62.86 117.47,57.78 118.75,56.52 U17.12 118.75,51.43 117.47,50.16 117.47,45.72 RN3.8 U16.12 118.75,38.73 117.47,37.46 v117.47,35.56 | v143.51,35.24 v143.51,55.24 v143.51,86.04 | v175.58,28.26 U25.12
D7  (via drill 0.5)
  Top 0.254: v144.46,84.77 U27.9 | U26.9 149.86,52.07 149.22,52.7 145.73,52.7 145.1,52.07 v144.46,52.07 | v176.85,28.26 173.35,31.75 148.91,31.75 v144.46,36.2 137.16,36.2 134.62,33.66 124.46,33.66 v121.28,36.83 | U21.5 110.17,96.2 v117.47,96.2
  Bottom 0.254: v144.46,36.2 v144.46,52.07 v144.46,84.77 | v176.85,28.26 180.34,24.77 181.61,24.77 U25.11 | v117.47,96.2 117.47,84.45 114.3,81.28 112.39,81.28 U19.9 111.12,79.06 120.02,70.17 120.02,64.14 118.75,62.86 U18.9 118.75,57.78 120.02,56.52 120.02,51.43 118.75,50.16 U17.9 RN3.9 120.02,43.18 120.02,38.1 v121.28,36.83 U16.9
INT_KB
  Bottom 0.254: U7.11 JP3.1
INT_UART1  (via drill 0.5)
  Top 0.254: U26.33 167.64,45.72 150.5,45.72 149.22,44.45 JP1.1 136.84,44.45 135.57,45.72 126.36,45.72 121.6,50.48 v120.65,50.48
  Bottom 0.254: U17.11 121.28,51.12 v120.65,50.48
INT_UART2  (via drill 0.5)
  Top 0.254: U27.33 167.64,78.42 150.5,78.42 149.22,77.15 JP2.1 145.1,78.74 114.94,78.74 113.98,77.79 v108.9,77.79
  Bottom 0.254: v108.9,77.79 112.39,74.3 112.39,71.76 114.3,69.85 115.57,69.85 117.47,67.95 117.47,64.14 116.2,62.86 116.2,61.91 114.94,60.64 114.94,58.42 117.47,55.88 117.47,51.43 116.2,50.16 U17.8
KB_CLOCK  (via drill 0.5)
  Top 0.254: R1.1 11.43,25.4 Q1.3 30.48,29.21 32.7,31.43 52.7,31.43 53.02,31.75 90.17,31.75 92.71,29.21 v98.42,29.21 99.06,28.57 142.24,28.57 144.15,26.67 165.74,26.67 166.69,25.72 175.58,25.72 177.8,27.94 186.69,27.94 188.59,29.85 TP2.1 192.41,29.85 192.87,29.39 J3.5
  Bottom 0.254: Q2.3 Q1.3 | U15.11 100.97,21.59 98.42,24.13 v98.42,29.21
KB_DATA  (via drill 0.5)
  Top 0.254: v51.44,30.48 52.7,30.48 53.34,31.12 89.85,31.12 92.71,28.26 v95.09,28.26 95.89,28.26 96.2,27.94 141.92,27.94 143.83,26.04 165.42,26.04 166.37,25.08 175.9,25.08 178.12,27.3 TP1.1 196.25,27.3 J3.1 | v51.44,43.81 36.83,43.81 35.56,45.09 23.5,45.09 20.32,48.26 Q3.3
  Bottom 0.254: v51.44,30.48 v51.44,43.81 | R5.1 10.79,55.24 15.24,50.8 Q3.3 | U15.13 95.89,19.68 95.09,20.48 v95.09,28.26
KB_DR  (via drill 0.5)
  Top 0.254: U17.13 114.94,55.88 v90.49,55.88 87,55.88 84.14,53.02 62.23,53.02 60.64,54.61 57.47,54.61 56.2,53.34 v21.59,53.34 | 62.87,96.52 67.94,96.52 68.9,95.57 v76.83,95.57 v90.49,95.57 | v38.73,96.52 62.87,96.52 | 62.87,96.52 U14.1
  Bottom 0.254: v90.49,95.57 v90.49,55.88 | v76.83,95.57 76.83,100.97 75.56,102.23 U14.9 | R3.1 21.59,44.45 v21.59,53.34 | v38.73,96.52 U7.12
KB_ERR  (via drill 0.5)
  Top 0.254: U17.6 109.86,45.72 100.33,45.72 99.06,44.45 93.34,44.45 88.58,39.69 62.23,39.69 60.96,40.96 v55.24,40.96 | v55.24,21.27 50.48,21.27 49.53,20.32 40.01,20.32 U2.3
  Bottom 0.254: v55.24,40.96 v55.24,21.27
KB_WRCYCLE  (via drill 0.5)
  Top 0.254: U17.15 109.86,53.34 97.79,53.34 96.52,54.61 86.68,54.61 84.45,52.39 61.91,52.39 60.33,53.97 57.78,53.97 56.2,52.39 v42.55,52.39 | v47.62,77.15 44.13,77.15 U6.11
  Bottom 0.254: U3.10 43.81,43.81 42.55,45.09 v42.55,52.39 42.55,56.52 43.81,57.78 U5.5 43.81,61.59 47.62,65.41 v47.62,77.15 | U6.11 41.27,81.92 42.55,83.19 42.55,88.27 43.81,89.54 U7.10
LOGO-C
  pour Top (no thermals): 16.9,108.39 16.74,107.71 13.74,107.71 13.26,105.83 16.24,105.83 16.07,105.14 12.78,105.14 arc-47 12.52,105.25 arc-36 12.38,105.57 arc-17 12.39,105.83 arc-5 12.41,105.98 12.82,107.56 arc-33 13.18,108.16 arc-31 13.56,108.38 arc-13 13.7,108.39
LOGO-I
  pour Top (no thermals): 11.52,108.39 12.4,108.39 11.55,105.14 10.68,105.14
LOGO-M
  pour Top (no thermals): 5.12,105.14 5.96,108.39 10.24,108.39 arc-50 10.58,108.27 arc-37 10.71,107.98 arc-17 10.68,107.6 10.04,105.14 9.16,105.14 9.83,107.71 8.69,107.71 8.03,105.14 7.14,105.14 7.81,107.71 6.67,107.71 6.01,105.14
LOGO-O
  pour Top (no thermals): 22.78,107.71 24.88,107.71 24.38,105.83 22.26,105.83 22.76,107.71 22.81,108.39 22.7,108.39 arc33 22.31,108.26 arc19 22.02,107.94 arc18 21.85,107.56 21.42,105.96 arc9 21.4,105.86 arc9 21.39,105.62 arc22 21.44,105.41 arc36 21.56,105.23 arc17 21.69,105.16 arc13 21.83,105.14 24.4,105.14 arc18 24.61,105.16 arc16 24.8,105.26 arc14 25.03,105.48 arc26 25.29,105.94 25.72,107.62 arc17 25.74,107.9 arc19 25.7,108.12 arc66 25.32,108.39 22.83,108.39
LOGO-R
  pour Top (no thermals): 17.55,108.39 18.25,107.71 18.08,107 20.19,107 20.36,107.71 18.28,107.71 17.58,108.39 20.71,108.39 arc-55 21.13,108.19 arc-31 21.24,107.93 arc-18 21.21,107.6 21.1,107.19 arc-18 21.02,107.01 arc-18 20.7,106.61 arc-19 20.39,106.41 arc-14 20.04,106.35 20.48,105.14 19.6,105.14 19.17,106.36 17.89,106.36 17.58,105.14 16.7,105.14
LOGO-X
  pour Top (no thermals): 0.83,105.14 1.81,105.14 2.92,106.17 3.49,105.14 4.53,105.14 3.59,106.77 5.37,108.39 4.38,108.39 3.26,107.36 2.69,108.39 1.66,108.39 2.59,106.74
N$1
  Top 0.254: U28.2 187.82,44.31 J1.1
N$2
  Top 0.254: U28.4 186.69,46.99 186.78,47.08 J1.2
N$3
  Top 0.254: U28.6 187.64,49.85 J1.3
N$4
  Top 0.254: U28.8 189.95,52.62 J1.4
N$5
  Top 0.254: U28.3 186.66,45.69 J1.6
N$6
  Top 0.254: U28.5 186.37,49.53 187.44,48.46 J1.7
N$7
  Top 0.254: U28.7 188.8,51.23 J1.8
N$8
  Top 0.254: U28.9 191.11,54 J1.9
N$9
  Top 0.254: U29.2 189.41,78.6 J2.1
N$10  (via drill 0.5)
  Top 0.254: v176.21,55.88 165.1,55.88 U26.43
  Bottom 0.254: U28.12 176.21,58.1 v176.21,55.88
N$11
  Top 0.254: U26.37 175.9,52.07 177.16,53.34 178.12,53.34 179.07,54.29 179.07,55.88 U28.13
N$12
  Top 0.254: U26.40 176.21,57.15 177.8,55.56 U28.14
N$13  (via drill 0.5)
  Top 0.254: U28.15 176.53,50.8 165.74,50.8 163.19,48.26 v155.26,48.26
  Bottom 0.254: U26.13 152.4,48.26 v155.26,48.26
N$14
  Top 0.254: U28.16 170.81,49.53 169.54,48.26 167.64,48.26 U26.36
N$15  (via drill 0.5)
  Top 0.254: v151.13,59.37 152.08,59.37 152.4,59.69 157.16,59.69 157.8,59.05 175.26,59.05 177.16,60.96 v179.71,60.96
  Bottom 0.254: v151.13,59.37 152.4,58.1 152.4,50.8 U26.11 | v179.71,60.96 179.07,60.32 179.07,48.26 U28.17
N$16  (via drill 0.5)
  Top 0.254: U26.41 167.64,53.34 175.58,53.34 v176.21,53.97
  Bottom 0.254: v176.21,53.97 176.21,46.04 U28.18
N$17  (via drill 0.5)
  Top 0.254: v180.02,58.42 165.1,58.42 U26.42
  Bottom 0.254: U28.19 180.02,44.13 v180.02,58.42
N$18
  Bottom 0.254: U26.17 152.4,43.18 154.31,43.18 156.21,45.09 156.21,51.12 155.26,52.07 U26.10
N$19  (via drill 0.5)
  Top 0.254: U4.5 45.09,45.72 v47.62,45.72
  Bottom 0.254: v47.62,45.72 47.62,38.73 46.35,37.46 U3.6
N$20  (via drill 0.5)
  Top 0.254: U14.11 66.67,101.6 53.98,101.6 v53.02,100.65
  Bottom 0.254: v53.02,100.65 53.02,60.64 48.9,56.52 U4.8
N$21  (via drill 0.5)
  Top 0.254: v37.47,50.16 38.1,50.8 85.72,50.8 88.27,53.34 95.89,53.34 97.16,52.07 123.83,52.07 125.09,50.8 130.18,50.8 131.44,49.53 v133.03,49.53 | R10.1 176.53,29.85 173.99,32.38 149.54,32.38 144.78,37.15 137.16,37.15 134.62,34.61 v133.35,34.61
  Bottom 0.254: v37.47,50.16 37.47,45.09 38.73,43.81 U3.12 | v133.35,34.61 133.35,48.26 133.03,48.58 v133.03,49.53
N$22  (via drill 0.5)
  Top 0.254: U5.12 37.47,68.58 v22.86,68.58 | v22.86,44.45 34.92,44.45 36.2,43.18 47.62,43.18 U3.8
  Bottom 0.254: v22.86,68.58 v22.86,44.45
N$23
  Bottom 0.254: U4.12 38.73,56.52 37.47,57.78 37.47,75.56 36.2,76.84 U6.13
N$24  (via drill 0.5)
  Top 0.254: R7.1 JP3.2 42.23,99.38 v26.99,99.38 | U4.1 v26.99,46.99
  Bottom 0.254: v26.99,46.99 v26.99,99.38
N$25  (via drill 0.5)
  Top 0.254: U23.8 131.44,36.83 130.18,35.56 v124.78,35.56 | v124.78,52.7 97.47,52.7 96.2,53.97 87.63,53.97 v85.41,51.75 | v86.68,33.02 86.04,32.38 35.56,32.38 U3.1
  Bottom 0.254: v124.78,35.56 v124.78,52.7 | v85.41,51.75 85.41,46.99 86.68,45.72 v86.68,33.02
N$26
  Top 0.254: U15.10 U15.9
N$27  (via drill 0.5)
  Top 0.254: C35.- v125.73,73.66
  Bottom 0.254: v125.73,73.66 125.73,71.12 U24.4
N$28
  Top 0.254: U29.4 187.09,81.37 J2.2
N$29
  Top 0.254: U29.6 186.69,84.77 187.32,84.14 J2.3
N$30
  Top 0.254: U29.8 188.37,86.91 J2.4
N$31
  Top 0.254: U29.3 188.25,79.98 J2.6
N$32
  Top 0.254: U29.5 186.69,82.23 187.21,82.75 J2.7
N$33
  Bottom 0.254: RN1.8 181.61,12.7 181.61,14.61 U25.9
N$34  (via drill 0.5)
  Top 0.254: P1.49 175.26,7.94 176.53,9.21 v177.16,9.21
  Bottom 0.254: v177.16,9.21 177.8,9.21 179.07,10.48 179.07,12.38 RN2.7
N$35
  Bottom 0.254: RN1.6 176.53,12.7 176.53,14.61 U25.7
N$36  (via drill 0.5)
  Top 0.254: P1.47 172.72,7.94 v173.99,9.21
  Bottom 0.254: v173.99,9.21 173.99,12.38 RN2.5
N$37
  Bottom 0.254: RN1.4 171.45,12.7 171.45,14.61 U25.5
N$38  (via drill 0.5)
  Top 0.254: P1.45 v170.18,9.21
  Bottom 0.254: v170.18,9.21 168.91,10.48 168.91,12.38 RN2.3
N$39
  Bottom 0.254: U25.3 166.37,14.61 166.37,12.7 RN1.2
N$40  (via drill 0.5)
  Top 0.254: P1.43 v167.64,9.21
  Bottom 0.254: v167.64,9.21 166.69,10.16 164.47,10.16 163.83,10.79 163.83,12.38 RN2.1
N$41
  Top 0.254: U29.7 187.21,85.52 J2.8
N$42
  Top 0.254: U29.9 189.52,88.29 J2.9
N$43
  Top 0.254: U24.2 123.51,74.93 C35.+
N$44
  Bottom 0.254: R10.2 186.06,16.51 188.59,13.97 Q4.2
N$45
  Bottom 0.254: U3.13 U4.2
N$46
  Top 0.254: U23.2 130.18,49.53 131.44,48.26 152.4,48.26 U26.14
N$47  (via drill 0.5)
  Top 0.254: U27.43 165.1,88.58 v176.21,88.58
  Bottom 0.254: v176.21,88.58 176.21,90.81 U29.12
N$48
  Top 0.254: U27.37 175.9,84.77 177.16,86.04 178.12,86.04 179.07,87 179.07,88.58 U29.13
N$49
  Top 0.254: U27.40 176.21,89.85 177.8,88.27 U29.14
N$50  (via drill 0.5)
  Top 0.254: U23.12 131.44,46.99 130.18,48.26 125.09,48.26 121.92,51.43 97.16,51.43 96.52,50.8 v87.63,50.8 | v87.63,91.44 61.59,91.44 60.96,92.08 57.15,92.08 56.52,91.44 37.47,91.44 U7.13
  Bottom 0.254: v87.63,50.8 v87.63,91.44
N$51
  Bottom 0.254: U27.38 165.1,86.04 165.1,93.66 J4.3
N$52
  Bottom 0.254: U27.35 167.64,83.5 167.64,93.66 J4.2
N$53
  Bottom 0.254: RN2.2 164.15,14.61 163.83,14.61 U25.2
N$54
  Bottom 0.254: U25.4 168.91,14.61 169.23,14.61 RN2.4
N$55
  Bottom 0.254: U25.6 173.99,14.61 174.31,14.61 RN2.6
N$56
  Bottom 0.254: U25.8 179.07,14.61 179.39,14.61 RN2.8
N$57
  Bottom 0.254: P1.50 175.26,8.89 RN1.7
N$58
  Bottom 0.254: P1.48 RN1.5
N$59
  Bottom 0.254: P1.46 170.18,7.94 167.64,10.48 RN1.3
N$60
  Top 0.254: U29.15 176.53,83.5 165.74,83.5 163.19,80.96 152.4,80.96 U27.13
N$61
  Top 0.254: U29.16 170.81,82.23 169.54,80.96 167.64,80.96 U27.36
N$62  (via drill 0.5)
  Top 0.254: v152.4,93.66 153.67,92.39 175.9,92.39 177.16,93.66 v179.71,93.66
  Bottom 0.254: U27.11 152.4,83.5 v152.4,93.66 | v179.71,93.66 179.07,93.03 179.07,80.96 U29.17
N$63  (via drill 0.5)
  Top 0.254: U27.41 167.64,86.04 175.58,86.04 v176.21,86.68
  Bottom 0.254: v176.21,86.68 176.21,78.74 U29.18
N$64  (via drill 0.5)
  Top 0.254: U27.42 165.1,91.12 v180.02,91.12
  Bottom 0.254: v180.02,91.12 180.02,76.84 U29.19
N$65
  Bottom 0.254: U27.10 154.94,83.5 154.94,79.06 154.31,78.42 153.03,78.42 152.4,77.79 152.4,76.84 151.13,75.56 U27.17
N$66
  Bottom 0.254: U11.17 67.94,69.85 66.04,69.85 64.14,71.76 64.14,75.56 65.41,76.84 U12.13 65.41,81.28 62.87,83.82 U13.1
N$67  (via drill 0.5)
  Top 0.254: v83.82,85.09 82.55,83.82 69.22,83.82 U13.3 | v83.82,69.85 v64.45,69.85
  Bottom 0.254: v83.82,85.09 v83.82,69.85 | v64.45,69.85 65.09,69.22 66.04,69.22 U11.18
N$68
  Bottom 0.254: P1.44 167.64,7.94 166.05,9.53 164.15,9.53 163.51,10.16 162.88,10.16 162.56,10.48 RN1.1
N$69  (via drill 0.5)
  Top 0.254: U4.3 40.96,44.77 52.39,44.77 53.34,43.81 87.63,43.81 v88.58,44.77 | v76.2,76.2 v88.58,76.2
  Bottom 0.254: U13.5 73.03,83.19 74.3,81.92 74.3,78.11 v76.2,76.2 | v88.58,76.2 v88.58,44.77
N$70  (via drill 0.5)
  Top 0.254: U7.2 33.34,82.23 v24.13,82.23 | v24.13,48.89 24.77,48.26 40.01,48.26 U4.4
  Bottom 0.254: U4.4 41.27,45.09 42.55,43.81 42.55,38.73 41.27,37.46 U3.4 | v24.13,82.23 v24.13,48.89
N$71  (via drill 0.5)
  Top 0.254: U11.11 84.45,68.58 v50.16,68.58 v40.01,68.58
  Bottom 0.254: U4.6 U4.9 46.35,56.52 45.09,57.78 45.09,60.96 50.16,66.04 v50.16,68.58 | v40.01,68.58 38.73,69.85 U6.3
N$72  (via drill 0.5)
  Top 0.254: U3.3 40.01,33.02 52.7,33.02 53.66,33.02 v54.29,33.66 | v54.93,86.36 69.22,86.36 U13.4
  Bottom 0.254: v54.29,33.66 54.29,59.37 54.93,60.01 v54.93,86.36
N$73
  Bottom 0.254: U11.14 76.83,68.58 72.71,68.58 69.22,72.07 69.22,75.56 67.94,76.84 U12.12
N$74
  Bottom 0.254: U11.13 78.11,69.85 73.98,69.85 71.75,72.07 71.75,75.56 70.48,76.84 U12.11
N$76  (via drill 0.5)
  Top 0.254: v83.19,62.55 v78.11,62.55
  Bottom 0.254: U12.6 76.83,71.12 81.28,71.12 84.45,67.95 84.45,64.77 83.19,63.5 v83.19,62.55 | v78.11,62.55 U11.7
N$77  (via drill 0.5)
  Top 0.254: v68.9,71.12 71.75,71.12 U12.5
  Bottom 0.254: U11.4 70.48,62.86 71.75,64.14 71.75,68.26 v68.9,71.12
N$78  (via drill 0.5)
  Top 0.254: v79.38,63.5 71.75,63.5 U11.3
  Bottom 0.254: U12.4 73.66,69.22 77.79,69.22 79.38,67.63 v79.38,63.5
N$79
  Top 0.254: U6.2 37.47,71.12 52.7,71.12 55.24,73.66 66.67,73.66 U12.3
N$81
  Top 0.254: U12.9 73.98,81.6 48.58,81.6 47.62,82.55 41.27,82.55 U7.3
  Bottom 0.254: U12.9 75.56,81.92 74.3,83.19 74.3,88.27 75.56,89.54 U13.9
N$82  (via drill 0.5)
  Top 0.254: v47.62,94.93 v66.67,94.93
  Bottom 0.254: U7.6 46.35,88.27 47.62,89.54 v47.62,94.93 | v66.67,94.93 66.67,100.97 65.41,102.23 U14.13
N$84  (via drill 0.5)
  Top 0.254: U6.5 42.55,73.66 v25.08,73.66 | v25.08,21.59 U2.1
  Bottom 0.254: v25.08,73.66 v25.08,21.59
N$86
  Top 0.254: U18.2 99.69,58.42 86.68,58.42 84.77,56.52 67.31,56.52 U10.13
  Bottom 0.254: U10.13 65.41,56.52 66.67,57.78 66.67,62.86 65.41,64.14 U11.19
N$87  (via drill 0.5)
  Top 0.254: U20.9 114.94,93.98 v55.88,93.98 | v55.88,57.15 v40.01,57.15
  Bottom 0.254: U3.11 41.27,43.81 40.01,45.09 v40.01,57.15 | v55.88,93.98 v55.88,57.15
N$90
  Top 0.254: U11.16 74.3,66.04 93.03,66.04 93.66,66.67 96.2,66.67 96.84,66.04 104.78,66.04 U18.17
  Bottom 0.254: U11.16 73.03,64.14 74.3,62.86 74.3,59.37 72.07,57.15 71.44,57.15 69.22,54.93 69.22,51.43 70.48,50.16 U10.4
N$91
  Top 0.254: U18.4 104.14,57.78 87,57.78 85.09,55.88 74.3,55.88 U10.10
  Bottom 0.254: U11.15 75.56,64.14 76.83,62.86 76.83,58.42 U10.10
N$92  (via drill 0.5)
  Top 0.254: U18.15 109.22,65.41 96.52,65.41 95.89,66.04 93.98,66.04 93.34,65.41 83.82,65.41 v83.19,64.77
  Bottom 0.254: U10.9 78.11,57.15 79.69,57.15 81.92,59.37 81.92,63.5 v83.19,64.77 U11.12
N$94  (via drill 0.5)
  Top 0.254: v114.94,62.23 97.16,62.23 95.89,60.96 93.98,60.96 93.34,61.59 76.2,61.59 v75.56,62.23
  Bottom 0.254: U10.11 U11.6 v75.56,62.23 | U18.13 116.2,64.14 114.94,62.86 v114.94,62.23
N$95
  Top 0.254: U18.8 114.3,61.59 97.47,61.59 96.2,60.32 93.66,60.32 93.03,60.96 74.3,60.96 U11.5
  Bottom 0.254: U11.5 U10.12
N$96
  Top 0.254: U18.11 118.75,64.77 96.52,64.77 95.25,63.5 81.92,63.5 80.96,64.45 70.17,64.45 U11.2
  Bottom 0.254: U11.2 65.41,58.1 64.14,56.83 64.14,51.43 65.41,50.16 U10.2
N$97
  Top 0.254: U10.8 84.77,54.61 87.31,57.15 108.58,57.15 U18.6
  Bottom 0.254: U11.9 U10.8
N$99  (via drill 0.5)
  Top 0.254: U20.7 112.39,83.82 100.97,83.82 99.69,82.55 48.9,82.55 47.62,83.82 v45.09,83.82
  Bottom 0.254: v45.09,83.82 45.09,88.27 46.35,89.54 U7.9
N$101  (via drill 0.5)
  Top 0.254: v85.25,18.73 83.66,17.14 70.48,17.14 69.85,17.78 54.61,17.78 54.29,17.46 38.73,17.46 36.2,20 U2.2 | v85.25,45.72 76.83,45.72 U10.6
  Bottom 0.254: v85.25,18.73 v85.25,45.72
N$102
  Bottom 0.254: U3.5 43.81,37.46 45.09,38.73 45.09,50.16 43.81,51.43 U4.10
N$103  (via drill 0.5)
  Top 0.254: U7.8 47.62,93.98 v24.45,93.98
  Bottom 0.254: v24.45,93.98 24.45,84.14 21.59,81.28 21.59,55.24 R4.1
N$105
  Top 0.254: Q2.2 11.43,41.91 R3.2
N$107  (via drill 0.5)
  Top 0.254: U23.10 133.03,41.91 131.76,43.18 93.34,43.18 88.27,38.1 47.62,38.1 46.35,39.37 v36.2,39.37
  Bottom 0.254: v36.2,39.37 U3.2
N$108  (via drill 0.5)
  Top 0.254: v45.09,90.17 56.52,90.17 57.78,91.44 60.33,91.44 60.96,90.81 73.03,90.81 v73.66,90.17
  Bottom 0.254: v73.66,90.17 74.3,90.81 74.3,94.62 75.56,95.89 U14.6 | U7.5 43.81,88.27 45.09,89.54 v45.09,90.17
N$111
  Bottom 0.254: U20.10 113.67,94.62 114.94,95.89 114.94,100.97 116.2,102.23 U21.9
N$114
  Top 0.254: U23.4 131.76,44.45 133.03,43.18 149.86,43.18 U26.15
  Bottom 0.254: U26.15 149.22,46.35 149.22,75.25 U27.15
N$115  (via drill 0.5)
  Top 0.254: v136.84,46.99 JP1.2
  Bottom 0.254: JP1.2 R8.2 | U23.9 136.84,41.59 v136.84,46.99
N$116  (via drill 0.5)
  Top 0.254: v145.41,73.98 147.32,72.07 U27.18 | v145.41,83.82 141.6,83.82 137.79,87.63 Y1.5
  Bottom 0.254: U26.18 154.94,40.64 154.94,42.54 156.84,44.45 156.84,52.07 154.94,53.97 154.94,69.53 153.67,70.8 U27.18 | v145.41,73.98 v145.41,83.82
N$118  (via drill 0.5)
  Top 0.254: v136.84,81.6 146.05,81.6 R9.2
  Bottom 0.254: JP2.2 R9.2 | U23.11 135.89,45.72 135.89,48.26 136.84,49.21 v136.84,81.6
N$120  (via drill 0.5)
  Top 0.254: U21.4 108.58,95.25 v118.75,95.25 | U19.5 109.86,71.12 116.52,71.12 v118.75,73.34
  Bottom 0.254: v118.75,95.25 v118.75,73.34
N$124
  Top 0.254: Q3.2 11.43,52.7 R4.2
N$126
  Top 0.254: Q1.2 11.43,33.66 R2.2
N$131  (via drill 0.5)
  Top 0.254: U5.9 44.77,65.72 v34.92,65.72
  Bottom 0.254: v34.92,65.72 34.92,64.14 33.66,62.86 U5.1
N$132
  Top 0.254: U6.8 46.99,81.92 34.29,81.92 33.66,81.28 14.61,81.28 U1.2
N$133
  Top 0.254: U1.7 U1.6 | R6.2 15.88,95.25 U1.6 | C31.1 14.61,91.44 U1.6
N$137  (via drill 0.5)
  Top 0.254: U4.13 34.92,55.88 v26.04,55.88 | v26.04,83.19 15.24,83.19 U1.3 | v26.04,33.66 R2.1
  Bottom 0.254: v26.04,83.19 v26.04,55.88 v26.04,33.66
N$140
  Bottom 0.254: C30.1 15.88,90.17 U1.5
RST  (via drill 0.5)
  Top 0.254: v173.35,54.61 U26.39 | v182.25,20.32 160.34,20.32 159.7,19.68 155.26,19.68 v153.67,18.1 | v125.73,38.1 135.57,38.1 136.84,39.37 146.05,39.37 150.5,34.92 153.35,34.92 v154.31,35.88 | v173.35,87.31 U27.39 | v94.61,15.56 v107.31,15.56 | v114.94,21.91 v108.58,21.91
  Bottom 0.254: v173.35,87.31 173.35,66.67 173.04,66.36 173.04,59.37 173.35,59.05 v173.35,54.61 173.35,34.92 184.15,24.13 184.15,22.23 v182.25,20.32 | v153.67,18.1 153.67,23.18 153.35,23.5 153.35,34.92 v154.31,35.88 | U15.1 93.34,13.34 94.61,14.61 v94.61,15.56 | v125.73,38.1 125.73,34.92 114.94,24.13 v114.94,21.91 | v108.58,21.91 107.31,20.64 v107.31,15.56 107.31,14.61 106.05,13.34 U15.6
UC4
  Bottom 0.254: U11.8 80.64,63.5 81.92,64.77 81.92,67.63 79.06,70.48 75.88,70.48 74.3,72.07 74.3,75.56 73.03,76.84 U12.10

## Text on the board
tPlace: JLCJLCJLCJLC
tNames: XMICRO-SERIAL | V1.0 2410 | PORT 2 | PORT 1 | CHRIS WEIR / ID $04
tValues: OP1 | OP2 | GND | KB INT | PORT 2 / INT | PORT 1 / INT | CGND